# Altium project Solder_Station_8786D_V2.PrjPcb
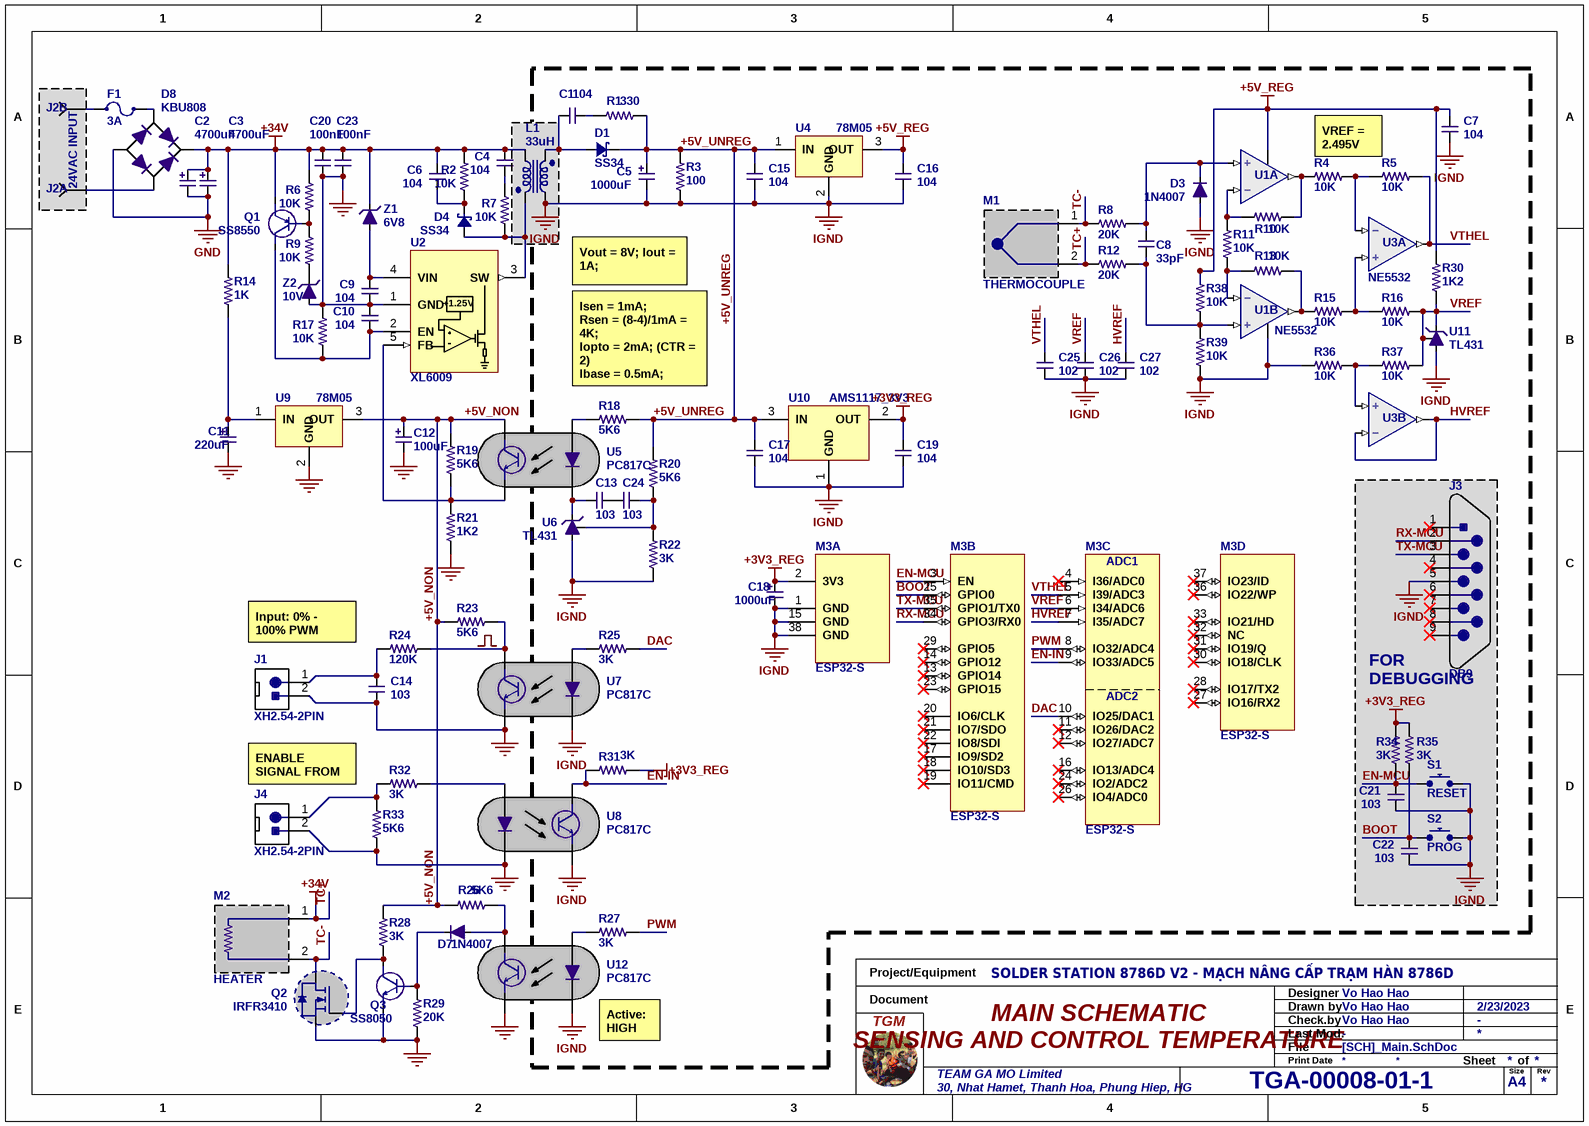
[diagram p0: [SCH]_Main.SchDoc]
1 sheet, 100 parts. Net scope: global (net labels, ports and power ports of the same name join across sheets).
Board file: [PCB]_Main.PcbDoc

## Sheet [SCH]_Main.SchDoc: MAIN SCHEMATIC
size 297 x 209 mm; CheckedBy: Vo Hao Hao; Author: Vo Hao Hao; CompanyName: TEAM GA MO; DrawnBy: Vo Hao Hao; Address1: TEAM GA MO Limited; Address2: 30, Nhat Hamet, Thanh Hoa, Phung Hiep, HG; TGM_Number: TGA-00008-01-1; Projet: SOLDER STATION 8786D V2 - MẠCH NÂNG CẤP TRẠM HÀN 8786D; ModifiedBy: -; CreateDate: 2/23/2023; CheckedDate: -; Title2: SENSING AND CONTROL TEMPERATURE; DivGrp: TGM; Designer: Vo Hao Hao

### Parts
C1  104  [CAP-SMD-0805]
C2  4700uF  [CAP_AL_DIP_18X35]
C3  4700uF  [CAP_AL_DIP_18X35]
C4  104  [CAP_NON_200mil]
C5  1000uF  [CAP_SMD_G]
C6  104  [CAP_NON_200mil]
C7  104  [CAP-SMD-0805]
C8  33pF  [CAP-SMD-0805]
C9  104  [CAP_NON_200mil]
C10  104  [CAP_NON_200mil]
C11  220uF  [CAP_AL_DIP_8x11.5]
C12  100uF  [CAP_AL_DIP_5x11]
C13  103  [CAP-SMD-0805]
C14  103  [CAP-SMD-0805]
C15  104  [CAP-SMD-0805]
C16  104  [CAP-SMD-0805]
C17  104  [CAP-SMD-0805]
C18  1000uF  [CAP_SMD_F]
C19  104  [CAP-SMD-0805]
C20  100nF  [CAP_NON_200mil]
C21  103  [CAP-SMD-0805]
C22  103  [CAP-SMD-0805]
C23  100nF  [CAP_NON_200mil]
C24  103  [CAP-SMD-0805]
C25  102  [CAP-SMD-0805]
C26  102  [CAP-SMD-0805]
C27  102  [CAP-SMD-0805]
D1  SS34  [DO-214AC]
D3  1N4007  [DIO-SMD-123]
D4  SS34  [DO-214AC]
D7  1N4007  [DIO-SMD-123]
D8  KBU808  [DIODE_KBU]
F1  3A  [FUSE_SMD_DIP]
HS1  ALU_8.8X8.8X5  [HEATSINK_ALU_8.8X8.8X5_TO252]  (value not drawn)
J1  XH2.54-2PIN  [Header 2P]
J2  24VAC  [Header 2P]  (value not drawn)  (parts A,B of 2)
J3  DB9
J4  XH2.54-2PIN  [Header 2P]
L1  33uH  [IND_4426_COUPLED]
M1  THERMOCOUPLE  [Header 2P]
M2  HEATER  [Header 2P]
M3  ESP32-S  [ESP32-S-Footprint]  (parts A,B,C,D of 4)
Q1  SS8550  [SOT23(123)]
Q2  IRFR3410  [TO252AA]
Q3  SS8050  [SOT23(123)]
R1  330  [RES_330_SMD_0805]
R2  10K  [RES_10K_SMD_0805]
R3  100  [RES_100_SMD_2512]
R4  10K  [RES_10K_SMD_0805]
R5  10K  [RES_10K_SMD_0805]
R6  10K  [RES_10K_SMD_0805]
R7  10K  [RES_10K_SMD_0805]
R8  20K  [RES_20K_SMD_0805]
R9  10K  [RES_10K_SMD_0805]
R10  10K  [RES_10K_SMD_0805]
R11  10K  [RES_10K_SMD_0805]
R12  20K  [RES_20K_SMD_0805]
R13  10K  [RES_10K_SMD_0805]
R14  1K  [RES_1K_5W_AXIAL_1000MIL]
R15  10K  [RES_10K_SMD_0805]
R16  10K  [RES_10K_SMD_0805]
R17  10K  [RES_10K_SMD_0805]
R18  5K6  [RES_5K6_SMD_0805]
R19  5K6  [RES_5K6_SMD_0805]
R20  5K6  [RES_5K6_SMD_0805]
R21  1K2  [RES_1K2_SMD_0805]
R22  3K  [RES_3K_SMD_0805]
R23  5K6  [RES_5K6_SMD_0805]
R24  120K  [RES_120K_SMD_0805]
R25  3K  [RES_3K_SMD_0805]
R26  5K6  [RES_5K6_SMD_0805]
R27  3K  [RES_3K_SMD_0805]
R28  3K  [RES_3K_SMD_0805]
R29  20K  [RES_20K_SMD_0805]
R30  1K2  [RES_1K2_SMD_0805]
R31  3K  [RES_3K_SMD_0805]
R32  3K  [RES_3K_SMD_0805]
R33  5K6  [RES_5K6_SMD_0805]
R34  3K  [RES_3K_SMD_0805]
R35  3K  [RES_3K_SMD_0805]
R36  10K  [RES_10K_SMD_0805]
R37  10K  [RES_10K_SMD_0805]
R38  10K  [RES_10K_SMD_0805]
R39  10K  [RES_10K_SMD_0805]
S1  RESET  [SW_TACT_3X3X1.5_SMD]
S2  PROG  [SW_TACT_3X3X1.5_SMD]
U1  NE5532  [SOIC-8S]  (value not drawn)  (parts A,B of 2)
U2  XL6009  [TO263]
U3  NE5532  [SOIC-8S]  (parts A,B of 2)
U4  78M05  [TO252AA]
U5  PC817C  [DIP4]
U6  TL431  [SOT23(132)]
U7  PC817C  [DIP4]
U8  PC817C  [DIP4]
U9  78M05  [TO252AA]
U10  AMS1117_3V3  [TO252AA]
U11  TL431  [SOT23(132)]
U12  PC817C  [DIP4]
Z1  6V8  [DIO-SMD-123]
Z2  10V  [DIO-SMD-123]

### Blocks framed on the sheet
24VAC INPUT: J2

### Nets
+3V3_REG: C18.1 C19.2 M3.2(3V3) R31.1 R34.2 R35.2 U10.2(OUT)
+5V_REG: C7.2 C16.2 R30.2 R38.2 U1.8(V+) U3.8(V+) U4.3(OUT)
GND: C2.2 C3.2 C9.1 C10.2 C11.2 C12.2 C14.1 C20.1 C23.1 D8.3 J1.2 J4.2 Q2.3(S) Q3.3(E) R17.2 R21.1 R29.1 R33.1 U2.1(GND) U7.3 U8.2 U9.2(GND) U12.3 Z2.1
IGND: C5.2 C7.1 C15.1 C16.1 C17.1 C18.2 C19.1 C21.1 C22.1 C25.1 C26.1 C27.1 D3.1 J3.5 L1.4 M3.1(GND) M3.15(GND) M3.38(GND) R3.1 R22.1 R36.1 R39.1 S1.2 S2.2 U1.4(V-) U3.4(V-) U4.2(GND) U6.3(A) U7.2 U8.3 U10.1(GND) U11.3(A) U12.2
TC+: C2.1 C3.1 C4.2 C6.2 C20.2 C23.2 D8.4 L1.1 M1.2 M2.1 Q1.3(E) R2.2 R6.2 R12.1 R14.2 Z1.2  [also labelled +34V]
V+: U1.4(V-) U1.8(V+)
+5V_NON: C12.1 R19.2 R23.2 R26.2 R28.2 U5.4 U9.3(OUT)
+5V_UNREG: C5.1 C15.2 C17.2 D1.2 R1.1 R3.2 R18.2 R20.2 U4.1(IN) U10.3(IN)
BOOT: C22.2 M3.25(GPIO0) R35.1 S2.1
DAC: M3.10(IO25/DAC1) R25.1
EN-IN: M3.9(IO33/ADC5) R31.2 U8.4
EN-MCU: C21.2 M3.3(EN) R34.1 S1.1
HVREF: C27.2 M3.7(I35/ADC7) U3.6(-IN) U3.7(OUT)
PWM: M3.8(IO32/ADC4) R27.1
RX-MCU: J3.2 M3.34(GPIO3/RX0)
TC-: M1.1 M2.2 Q2.2(D) R8.1
TX-MCU: J3.3 M3.35(GPIO1/TX0)
VREF: C26.2 M3.6(I34/ADC6) R16.1 R30.1 R37.2 U11.1(K) U11.2(R)
VTHEL: C25.2 M3.5(I39/ADC3) R5.1 U3.1(OUT)
NetC1_1: C1.1 R1.2
NetC1_2: C1.2 D1.1 L1.3
NetC4_1: C4.1 R7.2
NetC6_1: C6.1 D4.2 R2.1
NetC8_1: C8.1 R12.2 R38.1 R39.2 U1.5(+IN)
NetC8_2: C8.2 D3.2 R8.2 U1.3(+IN)
NetC9_2: C9.2 U2.4(VIN) Z1.1
NetC10_1: C10.1 Q1.2(C) R17.1 U2.2(EN)
NetC11_1: C11.1 R14.1 U9.1(IN)
NetC13_1: C13.1 U5.2 U6.1(K)
NetC13_2: C13.2 C24.1
NetC14_2: C14.2 J1.1 R24.1
NetC24_2: C24.2 R20.1 R22.2 U6.2(R)
NetD4_1: D4.1 L1.2 R7.1 U2.3(SW)
NetD7_1: D7.1 R26.1 U12.4
NetD7_2: D7.2 Q3.1(B) R29.2
NetD8_1: D8.1 J2.1
NetD8_2: D8.2 F1.2
NetF1_1: F1.1 J2.2
NetJ4_1: J4.1 R32.1 R33.2
NetQ1_1: Q1.1(B) R6.1 R9.2
NetQ2_1: Q2.1(G) Q3.2(C) R28.1
NetR4_1: R4.1 R5.2 U3.2(-IN)
NetR4_2: R4.2 R10.1 U1.1(OUT)
NetR9_1: R9.1 Z2.2
NetR10_2: R10.2 R11.1 U1.2(-IN)
NetR11_2: R11.2 R13.2 U1.6(-IN)
NetR13_1: R13.1 R15.2 U1.7(OUT)
NetR15_1: R15.1 R16.2 U3.3(+IN)
NetR18_1: R18.1 U5.1
NetR19_1: R19.1 R21.2 U2.5(FB) U5.3
NetR23_1: R23.1 R24.2 U7.4
NetR25_2: R25.2 U7.1
NetR27_2: R27.2 U12.1
NetR32_2: R32.2 U8.1
NetR36_2: R36.2 R37.1 U3.5(+IN)

Not connected (* = marked no-connect by the designer): J3 1* 4* 6* 7* 8* 9*; M3 4(I36/ADC0)* 11(IO26/DAC2)* 12(IO27/ADC7)* 13(GPIO14)* 14(GPIO12)* 16(IO13/ADC4)* 17(IO9/SD2)* 18(IO10/SD3)* 19(IO11/CMD)* 20(IO6/CLK)* 21(IO7/SDO)* 22(IO8/SDI)* 23(GPIO15)* 24(IO2/ADC2)* 26(IO4/ADC0)* 27(IO16/RX2)* 28(IO17/TX2)* 29(GPIO5)* 30(IO18/CLK)* 31(IO19/Q)* 32(NC)* 33(IO21/HD)* 36(IO22/WP)* 37(IO23/ID)*

### Notes on the sheet
- VREF = 2.495V
  55ppm/°C
- Vout = 8V; Iout = 1A;
- Isen = 1mA;
  Rsen = (8-4)/1mA = 4K;
  Iopto = 2mA; (CTR = 2)
  Ibase = 0.5mA;
  Rbot = 2.5/(2mA+0.5mA)=1K;
  Rtop = (5-2.5)/0.5mA = 5K;
- Input: 0% - 100% PWM
  Output: 5V - 0V
- (near J3) FOR
  DEBUGGING
- ENABLE SIGNAL FROM YIHUA
- (near U12) Active: HIGH
- Project/Equipment
- Document
- Designer
- Drawn by
- Check.by
- File
- Last Mod.
- Print Date
- Sheet
- Size
- A4
- of
- Rev
- (in symbol IC_XL6009_TO-263) +1.25V
- (in symbol MD_ESP32-S, part C) ADC1; ADC2

### Library data of the parts
C1 C7 C15-C17 C19 C25-C27 = CAP_NON_100NF_0805: Multilayer SMD Ceramic Capacitors, Vmax 50V; Container: Capacitors_Box; Label: 0805-100NF; Price: 0.006; Package: SMD; Stock: 76; Manufacturer: https://shopee.vn/Set-100-T%E1%BB%A5-%C4%90i%E1%BB%87n-G%E1%BB%91m-0805-SMD-100pF-47uF-100pF-1nF-10nF-100nF-0.1uF-1uF-2.2uF-4.7uF-10uF-22uF-i.778834786.13694429713; Temperature Range: -55 to +125 degC; ComponentLink1Description: Datasheet; ComponentLink1URL: E:\NEW_DATA\ELECTRONIC_DOCUMENT\DATASHEET\1723208.pdf
C2 C3 = CAP_POL_4700UF_50V_DIP: RS PRO Through Hole Aluminium Electrolytic Capacitor Low-ESR; Container: Capacitors_Box; Label: 4700UF-50V; Price: 0.8; Package: TH; Stock: 0; Manufacturer: https://shopee.vn/-2-CON-(G39.4)-T%E1%BB%A5-h%C3%B3a-4-700uF-50V-(18x35mm)-(4700uF-50V)-i.29971197.1779362195?sp_atk=89aaee08-9251-40b8-862a-376625eebb3c&xptdk=89aaee08-9251-40b8-862a-376625eebb3c; Temperature Range: -40 to +105 degC; ComponentLink1Description: Datasheet; ComponentLink1URL: E:\NEW_DATA\ELECTRONIC_DOCUMENT\DATASHEET\0900766b8173e32a.pdf; Value: 4700uF
C4 C6 C9 C10 C20 C23 = CAP_NON_100NF_50V_DIP: Ceramic Disc Capacitors, MCCHU Series; Container: Capacitors_Box; Label: 100nF-50V; Price: 0.004; Package: TH; Stock: 50; Manufacturer: https://shopee.vn/Set-100-T%E1%BB%A5-G%E1%BB%91m-50V-1pF-~-100nF-0.1uF-104-4.7PF-10PF-22PF-33PF-47PF-100PF-101-220PF-10NF-10NF-330PF-470PF-1NF-103-47NF-473-Ch%E1%BA%A5t-L%C6%B0%E1%BB%A3ng-Cao-i.778834786.17975668941?sp_atk=3a5fc38d-5123-497e-86f7-9862871296e1&xptdk=3a5fc38d-5123-497e-86f7-9862871296e1; Temperature Range: -25 to +85 degC; ComponentLink1Description: Datasheet; ComponentLink1URL: E:\NEW_DATA\ELECTRONIC_DOCUMENT\DATASHEET\2577800.pdf
C5 = CAP_POL_1000UF_16V_SMD: ALUMINUM  ELECTROLYTIC  CAPACITORS; Container: Capacitors_Box; Label: 1000uF-16V; Price: 0.08; Package: SMD; Stock: 10; Manufacturer: https://shopee.vn/Set-20-T%E1%BB%A5-%C4%90i%E1%BB%87n-Nh%C3%B4m-Smd-16v-10uf-22uf-33uf-47uf-100uf-220uf-330uf-470uf-680uf-1000uf-Chuy%C3%AAn-D%E1%BB%A5ng-i.395117932.9948514166; Temperature Range: -55 to +105 degC; ComponentLink1Description: Datasheet; ComponentLink1URL: E:\NEW_DATA\ELECTRONIC_DOCUMENT\DATASHEET\e-ut.pdf; Value: 1000uF
C8 = CAP_NON_33PF_0805: Multilayer SMD Ceramic Capacitors, Vmax 50V; Container: Capacitors_Box; Label: 0805-33PF; Price: 0.006; Package: SMD; Stock: 25; Manufacturer: https://shopee.vn/Set-100-T%E1%BB%A5-%C4%90i%E1%BB%87n-G%E1%BB%91m-0805-SMD-100pF-47uF-100pF-1nF-10nF-100nF-0.1uF-1uF-2.2uF-4.7uF-10uF-22uF-i.778834786.13694429713; Temperature Range: -55 to +125 degC; ComponentLink1Description: Datasheet; ComponentLink1URL: E:\NEW_DATA\ELECTRONIC_DOCUMENT\DATASHEET\1723208.pdf
C11 = CAP_POL_220UF_25V_DIP: RS PRO Through Hole Aluminium Electrolytic Capacitor Low-ESR, Rs=139mR, Ls=1.0uH; Container: Capacitors_Box; Label: 220UF-25V; Price: 0.04; Package: TH; Stock: 14; Manufacturer: https://shopee.vn/-10-CON-(G32.2)-T%E1%BB%A5-h%C3%B3a-220uF-25V-(8x12mm)-i.29971197.1779362283?sp_atk=29d1e278-aa24-4bd9-9bae-4cc1236b0b26&xptdk=29d1e278-aa24-4bd9-9bae-4cc1236b0b26; Temperature Range: -40 to +105 degC; ComponentLink1Description: Datasheet; ComponentLink1URL: E:\NEW_DATA\ELECTRONIC_DOCUMENT\DATASHEET\0900766b8173e32a.pdf; Value: 220uF
C12 = CAP_POL_100UF_16V_DIP: RS PRO Through Hole Aluminium Electrolytic Capacitor Low-ESR; Container: Capacitors_Box; Label: 100uF-16V; Price: 0.028; Package: TH; Stock: 46; Manufacturer: https://shopee.vn/-25-CON-T%E1%BB%A5-h%C3%B3a-100uF-16V-(6x7mm)-i.29971197.1779362306; Temperature Range: -40 to +105 degC; ComponentLink1Description: Datasheet; ComponentLink1URL: E:\NEW_DATA\ELECTRONIC_DOCUMENT\DATASHEET\0900766b8173e32a.pdf; Value: 100uF
C13 C14 C21 C22 C24 = CAP_NON_10NF_0805: Multilayer SMD Ceramic Capacitors, Vmax 50V; Container: Capacitors_Box; Label: 0805-10NF; Price: 0.006; Package: SMD; Stock: 89; Manufacturer: https://shopee.vn/Set-100-T%E1%BB%A5-%C4%90i%E1%BB%87n-G%E1%BB%91m-0805-SMD-100pF-47uF-100pF-1nF-10nF-100nF-0.1uF-1uF-2.2uF-4.7uF-10uF-22uF-i.778834786.13694429713; Temperature Range: -55 to +125 degC; ComponentLink1Description: Datasheet; ComponentLink1URL: E:\NEW_DATA\ELECTRONIC_DOCUMENT\DATASHEET\1723208.pdf
C18 = CAP_POL_1000UF_6.3V_SMD: ALUMINUM  ELECTROLYTIC  CAPACITORS; Container: Capacitors_Box; Label: 1000uF-6.3V; Price: 0.1; Package: SMD; Stock: 9; Manufacturer: https://shopee.vn/Set-10-t%E1%BB%A5-%C4%91i%E1%BB%87n-nh%C3%B4m-1uf-220uf-Smd-6.3v-47uf-100uf-220uf-470uf-1000uf-ch%E1%BA%A5t-l%C6%B0%E1%BB%A3ng-cao-i.395117932.8048512997?sp_atk=69990654-f080-47d0-9859-6bc27c5572f2&xptdk=69990654-f080-47d0-9859-6bc27c5572f2; Temperature Range: -55 to +105 degC; ComponentLink1Description: Datasheet; ComponentLink1URL: E:\NEW_DATA\ELECTRONIC_DOCUMENT\DATASHEET\e-ut.pdf; Value: 1000uF
D1 D4 = DIODE_SS34_3A_DO-214AC: Surface-Mount Schottky Barrier Rectifier, Vr=30V; Container: Diodes_Box; Label: Shockley; Price: 0.12; Package: SMD; Stock: 0; Manufacturer: https://shopee.vn/-5-CON-(KX)-Diode-D%C3%A1n-SS34-SMA-3A-40V-1N5822-(SMD-D%C3%A1n)-Diode-xung--i.29971197.1930547559?sp_atk=2e39dc6f-7249-4ff0-bc48-5163322d9dd4&xptdk=2e39dc6f-7249-4ff0-bc48-5163322d9dd4; Temperature Range: -55 to +150 degC; ComponentLink1Description: Datasheet; ComponentLink1URL: E:\NEW_DATA\ELECTRONIC_DOCUMENT\DATASHEET\ss32.pdf
D3 D7 = DIODE_1N4007_1A_SOD-323: 1A Rectifier Diodes - Vr 1000V; Container: Diodes_Box; Label: 1N4007 T7; ComponentLink1Description: Datasheet; ComponentLink1URL: E:\NEW_DATA\ELECTRONIC_DOCUMENT\DATASHEET\1N4007-SMD.pdf; Price: 0.006; Package: SMD; Temperature Range: -65 to +175 degC; Stock: 184; Manufacturer: https://shopee.vn/Set-100-Mi%E1%BA%BFng-D%C3%A1n-%C4%90i%E1%BB%91t-SMD-0805-SOD-123-1N5819-1N4007-1N4148-SOD123-SOD-323-1206-1N4148WS-1N5819WS-B5819WS-SOD323-i.778834786.19705430997?sp_atk=d684d704-d874-4419-9c16-214feca81d22&xptdk=d684d704-d874-4419-9c16-214feca81d22
D8 = DIODE_BRIDGE_KBU808_8A: SINGLE-PHASE SILICON BRIDGE RECTIFIER, 800V MAX, 560Vrms, 8A.; Container: Diodes_Box; ComponentLink1Description: Datasheet; ComponentLink1URL: E:\NEW_DATA\ELECTRONIC_DOCUMENT\DATASHEET\KBU8005-hornby.pdf; Price: 0.42; Package: TH; Stock: 0; Label: DIODE_BRIDGE; Manufacturer: https://shopee.vn/-2-CON-(F17.5)-C%E1%BA%A7u-Diode-KBU808-8A-800V-(8A-d%E1%BA%B9t)-i.29971197.1928264848?sp_atk=6ddc136f-6260-42f4-9059-366cf929f085&xptdk=6ddc136f-6260-42f4-9059-366cf929f085; Temperature Range: -55 to +125 degC
F1 = CON_CAR-FUSE_1A: RESISTOR-FUSE 1 OHM +-5% 0.5W @70; Package: TH
HS1 = HEATSINK_ALU_8.8X8.8X5: HEATSINK ALU 8.8X8.8X5 FROM CHINA; Price: 0.048; Package: SMD; Stock: 20; Container: HEATSINK; Label: ALU_8.8X8.8X5; Manufacturer: https://shopee.vn/Set-5-mi%E1%BA%BFng-nh%C3%B4m-t%E1%BA%A3n-nhi%E1%BB%87t-cao-c%E1%BA%A5p-c%E1%BB%A1-8.8x8.8x5mm-cho-chip-nh%E1%BB%9B-LED-i.410956428.9172920161?xptdk=409fad90-44e0-46f3-a162-0b94c27037a3; Temperature Range: -55 to +150 degC
J1 J4 = CON_HEADER_XH2.54-2PIN: 2.5mm pitch/Disconnectable Crimp style connectors.; Container: Bus_Wire_Box; Label: XH2.54; Price: 0.009; Package: TH; Stock: 14; Manufacturer: https://shopee.vn/%C4%90%E1%BA%A7u-n%E1%BB%91i-XH2.54-%C4%90%E1%BB%B1c-C%C3%A1i-C%C3%A1c-Lo%E1%BA%A1i-Header-XH2.54-lo%E1%BA%A1i-%C4%91%E1%BB%B1c-th%E1%BA%B3ng-i.151571719.3589152280?sp_atk=5406bfb8-bf62-463e-a06d-2acb89645f90&xptdk=5406bfb8-bf62-463e-a06d-2acb89645f90; Temperature Range: -25 to +85 degC; ComponentLink1Description: Datasheet; ComponentLink1URL: E:\NEW_DATA\ELECTRONIC_DOCUMENT\DATASHEET\5448.pdf
J2 = JP2_IN: Package: TH
J3 = CON_HEADER_DB9: DE-9 connector Male,  (COM PORT); Container: Bus_Wire_Box; Price: 0.35; Package: TH; Stock: 0; Label: DB9; Manufacturer: https://shopee.vn/%C4%91%C3%A2%CC%80u-com-rs232-9-ch%C3%A2n-%C4%91%E1%BA%A7u-%C4%91%C6%B0%CC%A3c-v%C3%A0-%C4%91%E1%BA%A7u-ca%CC%81i-kh%C3%B4ng-co%CC%81-d%C3%A2y-ke%CC%80m-i.59506575.11391940071; Temperature Range: -25 to +85 degC
L1 = IND_COUPLED_4426: Transformer Lpri=33uH; Lsec=33uH.; Container: Inductors_Box; Label: 4426_33uH; Coupling Factor: 0.95; Price: 0.1; Package: TH; Stock: 1; Manufacturer: https://shopee.vn/Set-10-Cu%E1%BB%99n-D%C3%A2y-C%E1%BA%A3m-%E1%BB%A8ng-T%E1%BB%AB-T%C3%ADnh-5026-33-47-68-100UH-6A-i.81431289.15993908560; Temperature Range: -40 to +125 degC; ComponentLink1Description: Datasheet; ComponentLink1URL: E:\NEW_DATA\ELECTRONIC_DOCUMENT\DATASHEET\CWS-1TC-11892 REV.A1.pdf; Inductance A: 33uH; Inductance B: 33uH
M1 = MD_THERMOCOUPLE: Type K Thermocouple; Container: Bus_Wire_Box; Label: XH2.54; Price: 0.009; Package: TH; Stock: 14; Manufacturer: https://shopee.vn/%C4%90%E1%BA%A7u-n%E1%BB%91i-XH2.54-%C4%90%E1%BB%B1c-C%C3%A1i-C%C3%A1c-Lo%E1%BA%A1i-Header-XH2.54-lo%E1%BA%A1i-%C4%91%E1%BB%B1c-th%E1%BA%B3ng-i.151571719.3589152280?sp_atk=5406bfb8-bf62-463e-a06d-2acb89645f90&xptdk=5406bfb8-bf62-463e-a06d-2acb89645f90; Temperature Range: -25 to +85 degC
M2 = MD_HEATER: Resistive heater; Container: Bus_Wire_Box; Label: XH2.54; Price: 0.009; Package: TH; Stock: 14; Manufacturer: https://shopee.vn/%C4%90%E1%BA%A7u-n%E1%BB%91i-XH2.54-%C4%90%E1%BB%B1c-C%C3%A1i-C%C3%A1c-Lo%E1%BA%A1i-Header-XH2.54-lo%E1%BA%A1i-%C4%91%E1%BB%B1c-th%E1%BA%B3ng-i.151571719.3589152280?sp_atk=5406bfb8-bf62-463e-a06d-2acb89645f90&xptdk=5406bfb8-bf62-463e-a06d-2acb89645f90; Temperature Range: -25 to +85 degC
M3 = MD_ESP32-S: Tensilica Xtensa LX6 microprocessor @ 160 or 240 MHz · 320 KiB SRAM, MCU; Container: ICs_Box; Temperature Range: -40 to +125 degC; Price: 2.3; Package: SMD; Stock: 0; Label: MCU; Manufacturer: https://shopee.vn/M%C3%B4-%C4%90un-Wifi-Kh%C3%B4ng-D%C3%A2y-Esp32-Esp32-Wroom-Esp32-Wrover-Esp32-Wroom-32D-32U-Esp32-Wrover-I-Ib-B-i.81431289.10939223124; ComponentLink1Description: Datasheet; ComponentLink1URL: E:\NEW_DATA\ELECTRONIC_DOCUMENT\DATASHEET\esp-wroom-32_datasheet_en-1223836.pdf
Q1 = PNP_SS8550_SOT-23: PNP Silicon General Purpose Transistor, Vcb=-40V, Ic=-1.5A, Y2; Container: Transistors_Box; Price: 0.006; Package: SMD; Stock: 100; Label: PNP; Manufacturer: https://shopee.vn/B%E1%BB%99-100-M%E1%BA%A1ch-%C4%90i%E1%BB%87n-SS8050-Y1-SS8550-Y2-S8050-J3Y-S8550-2TY-S9012-S9013-S9014-S9015-S9018-TL431-XC6206P332MR-SOT23-XC6206P332-i.778834786.17075451311; Temperature Range: -55 to +150 degC; ComponentLink1Description: Datasheet; ComponentLink1URL: E:\NEW_DATA\ELECTRONIC_DOCUMENT\DATASHEET\SS8550.pdf
Q2 = NCH_IRFR3410_TO-252: HEXFET  Power MOSFET, Vds=100V, Id=31A, Rds=34m; Container: Transistors_Box; Label: N-CH; Price: 0.15; Package: SMD; Stock: 0; Manufacturer: https://item.taobao.com/item.htm?spm=a1z10.3-c-s.w4002-21047669632.10.3f9827e5NgGYbt&id=523832631224; Temperature Range: -55 to +170 degC; ComponentLink1Description: Datasheet; ComponentLink1URL: E:\NEW_DATA\ELECTRONIC_DOCUMENT\DATASHEET\Infineon-IRFR3410-DataSheet-v01_01-EN.pdf
Q3 = NPN_SS8050_SOT-23: NPN Silicon Epitaxial Planar Transistor, Vcb=40V, Ic=1.5A, Y1; Container: Transistors_Box; Price: 0.005; Package: SMD; Stock: 87; Label: NPN; Manufacturer: https://shopee.vn/B%E1%BB%99-100-M%E1%BA%A1ch-%C4%90i%E1%BB%87n-SS8050-Y1-SS8550-Y2-S8050-J3Y-S8550-2TY-S9012-S9013-S9014-S9015-S9018-TL431-XC6206P332MR-SOT23-XC6206P332-i.778834786.17075451311; Temperature Range: -55 to +150 degC; ComponentLink1Description: Datasheet; ComponentLink1URL: E:\NEW_DATA\ELECTRONIC_DOCUMENT\DATASHEET\1912111437_Galaxy-SS8050G-Y1_C380930.pdf
R1 = RES_330R_1/8W_0805: Chip Resistor Surface Mount, 0.125W, Vmax 150V; Container: Resistors_Box; Label: 0805_Pack; Price: 0.003; Package: SMD; Stock: 70; Manufacturer: https://shopee.vn/Set-100con-%C4%90I%E1%BB%86N-TR%E1%BB%9E-D%C3%81N-0805-c%C3%A1c-lo%E1%BA%A1i-t%E1%BB%AB-2-OHM-7-3-OHM-9-4-OHM-7-6-OHM-8-8-OHM-2-12-OHM-...750-OHM-i.633971954.14528730832; Temperature Range: -55 to +155 degC; ComponentLink1Description: Datasheet; ComponentLink1URL: E:\NEW_DATA\ELECTRONIC_DOCUMENT\DATASHEET\RC0805.pdf; Value: 330
R2 R4-R7 R9-R11 R13 R15-R17 R36-R39 = RES_10K_1/8W_0805: Chip Resistor Surface Mount, 0.125W, Vmax 150V; Container: Resistors_Box; Label: 0805_Pack; Price: 0.003; Package: SMD; Stock: 19; Manufacturer: https://shopee.vn/Set-100con-%C4%90I%E1%BB%86N-TR%E1%BB%9E-D%C3%81N-0805-c%C3%A1c-lo%E1%BA%A1i-t%E1%BB%AB-1K2-3K-5K6-6K8-...820K-1M-i.633971954.15028739620; Temperature Range: -55 to +155 degC; ComponentLink1Description: Datasheet; ComponentLink1URL: E:\NEW_DATA\ELECTRONIC_DOCUMENT\DATASHEET\RC0805.pdf; Value: 10K
R3 = RES_100R_1/2W_2512: 2512 Thick Film Chip Resistor, 0.5W, Vmax 200V; Container: Resistors_Box; Label: 2512-100R 5%; Price: 0.003; Package: SMD; Stock: 46; Manufacturer: https://shopee.vn/Set-50-chip-%C4%90i%E1%BB%87n-T%E1%BB%AD-2512-SMD-5-1W-0.1R-0.01R-0.05R-0.001R-0.33R-1R-0R-10R-100R-2W-0.001-0.01-0.13-0.05-1-0-10-100-ohm-i.778834786.21104749216; Temperature Range: -55 to +155 degC; ComponentLink1Description: Datasheet; ComponentLink1URL: E:\NEW_DATA\ELECTRONIC_DOCUMENT\DATASHEET\2512std.pdf; Value: 100
R8 R12 R29 = RES_20K_1/8W_0805: Chip Resistor Surface Mount, 0.125W, Vmax 150V; Container: Resistors_Box; Label: 0805_Pack; Price: 0.003; Package: SMD; Stock: 89; Manufacturer: https://shopee.vn/Set-100con-%C4%90I%E1%BB%86N-TR%E1%BB%9E-D%C3%81N-0805-c%C3%A1c-lo%E1%BA%A1i-t%E1%BB%AB-1K2-3K-5K6-6K8-...820K-1M-i.633971954.15028739620; Temperature Range: -55 to +155 degC; ComponentLink1Description: Datasheet; ComponentLink1URL: E:\NEW_DATA\ELECTRONIC_DOCUMENT\DATASHEET\RC0805.pdf; Value: 20K
R14 = RES_1K_5W_AXIAL: Cement Fixed Resistors Axial Leaded; Container: Resistors_TH_Box; Label: 1K_5W; Value: 0.1; Price: 0.08; Package: TH; Stock: 3; Manufacturer: https://shopee.vn/%C4%90i%E1%BB%87n-tr%E1%BB%9F-s%E1%BB%A9-5W-5-b%E1%BB%99-5-con-c%C3%A1c-lo%E1%BA%A1i-0.1R-100K-i.101915397.11507078815; Temperature Range: -55 to +155 degC; ComponentLink1Description: Datasheet; ComponentLink1URL: E:\NEW_DATA\ELECTRONIC_DOCUMENT\DATASHEET\3178893.pdf
R18-R20 R23 R26 R33 = RES_5K6_1/8W_0805: Chip Resistor Surface Mount, 0.125W, Vmax 150V; Container: Resistors_Box; Label: 0805_Pack; Price: 0.003; Package: SMD; Stock: 40; Manufacturer: https://shopee.vn/Set-100con-%C4%90I%E1%BB%86N-TR%E1%BB%9E-D%C3%81N-0805-c%C3%A1c-lo%E1%BA%A1i-t%E1%BB%AB-1K2-3K-5K6-6K8-...820K-1M-i.633971954.15028739620; Temperature Range: -55 to +155 degC; ComponentLink1Description: Datasheet; ComponentLink1URL: E:\NEW_DATA\ELECTRONIC_DOCUMENT\DATASHEET\RC0805.pdf; Value: 5K6
R21 R30 = RES_1K2_1/8W_0805: Chip Resistor Surface Mount, 0.125W, Vmax 150V; Container: Resistors_Box; Label: 0805_Pack; Price: 0.003; Package: SMD; Stock: 50; Manufacturer: https://shopee.vn/Set-100con-%C4%90I%E1%BB%86N-TR%E1%BB%9E-D%C3%81N-0805-c%C3%A1c-lo%E1%BA%A1i-t%E1%BB%AB-1K2-3K-5K6-6K8-...820K-1M-i.633971954.15028739620; Temperature Range: -55 to +155 degC; ComponentLink1Description: Datasheet; ComponentLink1URL: E:\NEW_DATA\ELECTRONIC_DOCUMENT\DATASHEET\RC0805.pdf; Value: 1K2
R22 R25 R27 R28 R31 R32 R34 R35 = RES_3K_1/8W_0805: Chip Resistor Surface Mount, 0.125W, Vmax 150V; Container: Resistors_Box; Label: 0805_Pack; Price: 0.003; Package: SMD; Stock: 78; Manufacturer: https://shopee.vn/Set-100con-%C4%90I%E1%BB%86N-TR%E1%BB%9E-D%C3%81N-0805-c%C3%A1c-lo%E1%BA%A1i-t%E1%BB%AB-1K2-3K-5K6-6K8-...820K-1M-i.633971954.15028739620; Temperature Range: -55 to +155 degC; ComponentLink1Description: Datasheet; ComponentLink1URL: E:\NEW_DATA\ELECTRONIC_DOCUMENT\DATASHEET\RC0805.pdf; Value: 3K
R24 = RES_120K_1/8W_0805: Chip Resistor Surface Mount, 0.125W, Vmax 150V; Container: Resistors_Box; Label: 0805_Pack; Price: 0.003; Package: SMD; Stock: 99; Manufacturer: https://shopee.vn/Set-100con-%C4%90I%E1%BB%86N-TR%E1%BB%9E-D%C3%81N-0805-c%C3%A1c-lo%E1%BA%A1i-t%E1%BB%AB-1K2-3K-5K6-6K8-...820K-1M-i.633971954.15028739620; Temperature Range: -55 to +155 degC; ComponentLink1Description: Datasheet; ComponentLink1URL: E:\NEW_DATA\ELECTRONIC_DOCUMENT\DATASHEET\RC0805.pdf; Value: 120K
S1 S2 = CON_BUTTON_3X3X1.5MM_SMD: Tact switch (Tactile Switch), 50mA, 12VDC.; Container: Connector_Fuse_Box; Label: Tact Switch 4.5X4.5X5; Price: 0.028; Package: TH; Stock: 10; Manufacturer: https://shopee.vn/N%C3%BAt-Nh%E1%BA%A5n-4-Ch%C3%A2n-Vu%C3%B4ng-%C4%90en-i.101915397.10716198032; Temperature Range: -25 to +85 degC; ComponentLink1Description: Datasheet; ComponentLink1URL: E:\NEW_DATA\ELECTRONIC_DOCUMENT\DATASHEET\tact-switch.pdf
U1 U3 = IC_OPAMP_NE5532_SOIC-8: NE5532x, SA5532x Dual Low-Noise Operational Amplifiers.; Container: ANALOG_IC_BOX; Label: OPAMP; Price: 0.133; Package: SMD; Stock: 11; Manufacturer: https://shopee.vn/Set-20-Linh-Ki%E1%BB%87n-%C4%90i%E1%BB%87n-T%E1%BB%AD-NE5532DR-SOP8-NE5532-SOP-N5532-5532DR-SOP-8-SMD-Chuy%C3%AAn-D%E1%BB%A5ng-i.954274863.23824593163?sp_atk=b687206c-d197-40a7-9d70-90e3cf2b2040&xptdk=b687206c-d197-40a7-9d70-90e3cf2b2040; Temperature Range: -40 to +85 degC; ComponentLink1Description: Datasheet; ComponentLink1URL: E:\NEW_DATA\ELECTRONIC_DOCUMENT\DATASHEET\ne5532.pdf
U2 = IC_XL6009_TO-263: 400KHz 42V 5A Switching Current Boost DC/DC Converter, Wide 3.6V to 36V Input Voltage Range.; Container: COMMON_IC; Label: MODULATORS; ComponentLink1Description: Datasheet; ComponentLink1URL: E:\NEW_DATA\ELECTRONIC_DOCUMENT\DATASHEET\XL6009.pdf; Package: SMD; Stock: 0; Manufacturer: https://shopee.vn/B%E1%BB%99-5-Linh-Ki%E1%BB%87n-%C4%90i%E1%BB%87n-T%E1%BB%AD-XL4015E1-HS4015E1-TO263-XL4015-TO263-5-4015E1-TO-263-IBUW-XL4005E1-XL4005-XL6006E1-XL6006-XL6009E1-XL6009-XL6019E1-XL6019-i.827232370.11197288834?sp_atk=157a3557-8b9b-4be9-acdb-b91832632816&xptdk=157a3557-8b9b-4be9-acdb-b91832632816; Temperature Range: -25 to +85 degC; Price: 0.35
U4 U9 = IC_7805_TO-252: µA7800 SERIES POSITIVE-VOLTAGE REGULATORS, Imax=1.5A; Container: COMMON_IC; Price: 0.065; Package: SMD; Stock: 8; Label: REGULATOR; Manufacturer: https://shopee.vn/Set-10-linh-ki%E1%BB%87n-%C4%91i%E1%BB%87n-t%E1%BB%AD-78M05-TO252-7805-L78M05CDT-78M06-78M08-78M09-78M12-78M15-7806-7808G-i.395117932.9460732059; Temperature Range: -65 to +150 degC; ComponentLink1Description: Datasheet; ComponentLink1URL: E:\NEW_DATA\ELECTRONIC_DOCUMENT\DATASHEET\LM7805.pdf
U5 U7 U8 U12 = IC_OPTO_PC817C_DIP-4: PC817X Series, DIP 4pin General, Purpose Photocoupler.; Container: COMMON_IC; Price: 0.1; Package: TH; Stock: 4; Label: PC817C; Manufacturer: https://shopee.vn/S%E1%BA%A3n-ph%E1%BA%A9m-Opto-PC817-Sharp-5V-5mA-i.311128107.8022468113; Temperature Range: -30 to +100 degC; ComponentLink1Description: Datasheet; ComponentLink1URL: E:\NEW_DATA\ELECTRONIC_DOCUMENT\DATASHEET\PC817X Series.pdf
U6 U11 = IC_TL431_SOT-23: PROGRAMMABLE PRECISION / REFERENCE, Vmax=36V; Container: COMMON_IC; Price: 0.013; Stock: 0; Label: TL431; Manufacturer: https://shopee.vn/B%E1%BB%99-100-M%E1%BA%A1ch-%C4%90i%E1%BB%87n-SS8050-Y1-SS8550-Y2-S8050-J3Y-S8550-2TY-S9012-S9013-S9014-S9015-S9018-TL431-XC6206P332MR-SOT23-XC6206P332-i.778834786.17075451311; ComponentLink1Description: Datasheet; ComponentLink1URL: E:\NEW_DATA\ELECTRONIC_DOCUMENT\DATASHEET\TL431.pdf; Package: SMD; Temperature Range: -40 to +125 degC
U10 = IC_AMS1117_3V3_TO-252: 1A LOW DROPOUT VOLTAGE REGULATOR, Vmax 15V; Container: COMMON_IC; ComponentLink1Description: Datasheet; ComponentLink1URL: E:\NEW_DATA\ELECTRONIC_DOCUMENT\DATASHEET\ds1117.pdf; Price: 0.11; Package: SMD; Stock: 10; Label: AMS1117; Manufacturer: https://shopee.vn/Set-70-B%E1%BB%99-%C4%90i%E1%BB%81u-Ch%E1%BB%89nh-%C4%90i%E1%BB%87n-%C3%81p-AMS1117-1.2V-1.5V-1.8V-2.5V-3.3V-5.0V-ADJ-AMS1117-3.3V-AMS1117-3.3-AMS1117-5.0-7-Gi%C3%A1-Tr%E1%BB%8B-M%E1%BB%97i-Lo%E1%BA%A1i-i.778834786.19805430939?sp_atk=74066310-54b3-4280-a069-18140e90727b&xptdk=74066310-54b3-4280-a069-18140e90727b; Temperature Range: -40 to +125 degC
Z1 = ZENER_6V8_0.3W_SOD323: Voltage regulator diodes, BZX384 series; Power: 300mW; Container: Diodes_Box; Label: BZT52C6V8; Price: 0.008; Stock: 93; Manufacturer: https://shopee.vn/Set-270-%C4%91i-%E1%BB%91t-%E1%BB%95n-%C3%A1p-(2V4-33V)-1-2W-chuy%C3%AAn-d%E1%BB%A5ng-i.101758806.1635771682; ComponentLink1Description: Datasheet; ComponentLink1URL: E:\NEW_DATA\ELECTRONIC_DOCUMENT\DATASHEET\0900766b813e43ab.pdf; Package: SMD; Temperature Range: -65 to +150 degC
Z2 = ZENER_10V_0.3W_SOD-323: Voltage regulator diodes, BZX384 series; Power: 300mW; Container: Diodes_Box; Label: BZT52C10V; Vbreak: 10; Price: 0.008; Stock: 99; Manufacturer: https://shopee.vn/Set-100-%C4%90i%E1%BB%91t-SMD-0805-0.25W-BZT52C10V-3V3-7V5-6V8-5V6-5V1-4V7-12V-10V-15V-16V-18V-20V-24V-SOD-323-i.778834786.18605884639; ComponentLink1Description: Datasheet; ComponentLink1URL: E:\NEW_DATA\ELECTRONIC_DOCUMENT\DATASHEET\0900766b813e43ab.pdf; Package: SMD; Temperature Range: -65 to +150 degC